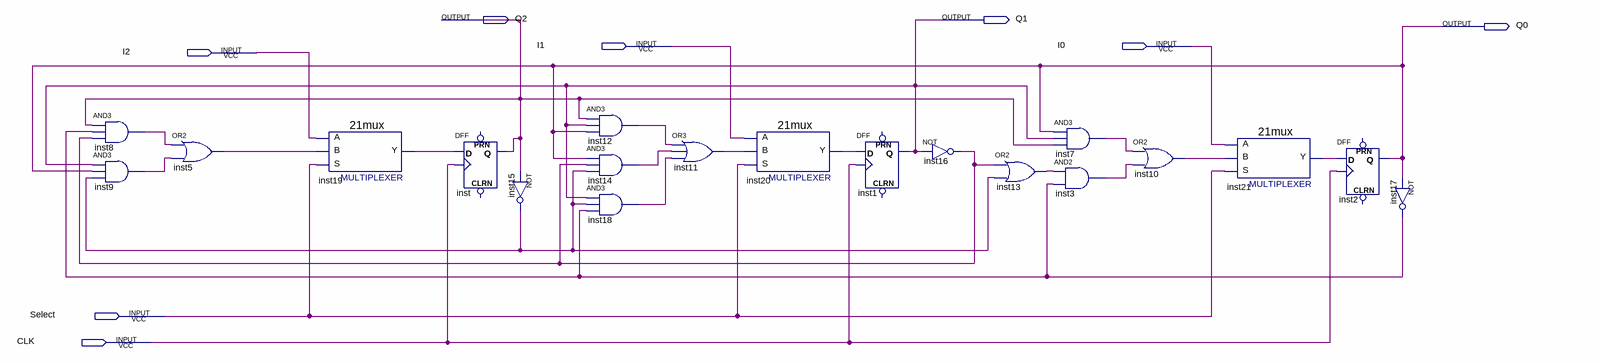
[diagram p0: schematic sheet]
// Quartus schematic counter.bdf as structural Verilog: 20 symbols, 8 pins
module counter (
  input  I1,
  input  I0,
  input  I2,
  input  Select,
  input  CLK,
  output Q2,
  output Q1,
  output Q0
);

  wire inst3_out, inst5_out, inst7_out, inst8_out, inst9_out, inst10_out, inst11_out, inst12_out, inst13_out,
       inst14_out, inst15_out, inst16_out, inst17_out, inst18_out, inst19_y, inst20_y, inst21_y;

  and inst8 (inst8_out, Q2, inst17_out, inst16_out);
  and inst9 (inst9_out, Q1, Q0, inst15_out);
  or inst5 (inst5_out, inst8_out, inst9_out);
  \21mux  inst19 (.S(Select), .B(inst5_out), .A(I2), .Y(inst19_y));
  DFF inst (.CLK(CLK), .D(inst19_y), .Q(Q2));  // open: CLRN, PRN
  not inst15 (inst15_out, Q2);
  and inst12 (inst12_out, Q2, Q1, Q0);
  and inst14 (inst14_out, Q0, inst16_out, inst15_out);
  and inst18 (inst18_out, Q1, inst15_out, inst17_out);
  or inst11 (inst11_out, inst12_out, inst14_out, inst18_out);
  \21mux  inst20 (.S(Select), .B(inst11_out), .A(I1), .Y(inst20_y));
  DFF inst1 (.CLK(CLK), .D(inst20_y), .Q(Q1));  // open: CLRN, PRN
  not inst16 (inst16_out, Q1);
  or inst13 (inst13_out, inst16_out, inst15_out);
  and inst7 (inst7_out, Q0, Q1, Q2);
  and inst3 (inst3_out, inst13_out, inst17_out);
  or inst10 (inst10_out, inst7_out, inst3_out);
  \21mux  inst21 (.S(Select), .B(inst10_out), .A(I0), .Y(inst21_y));
  DFF inst2 (.CLK(CLK), .D(inst21_y), .Q(Q0));  // open: CLRN, PRN
  not inst17 (inst17_out, Q0);
endmodule
